# EAGLE design TP4056 PROTECTION PCB (EAGLE 9.3.1)
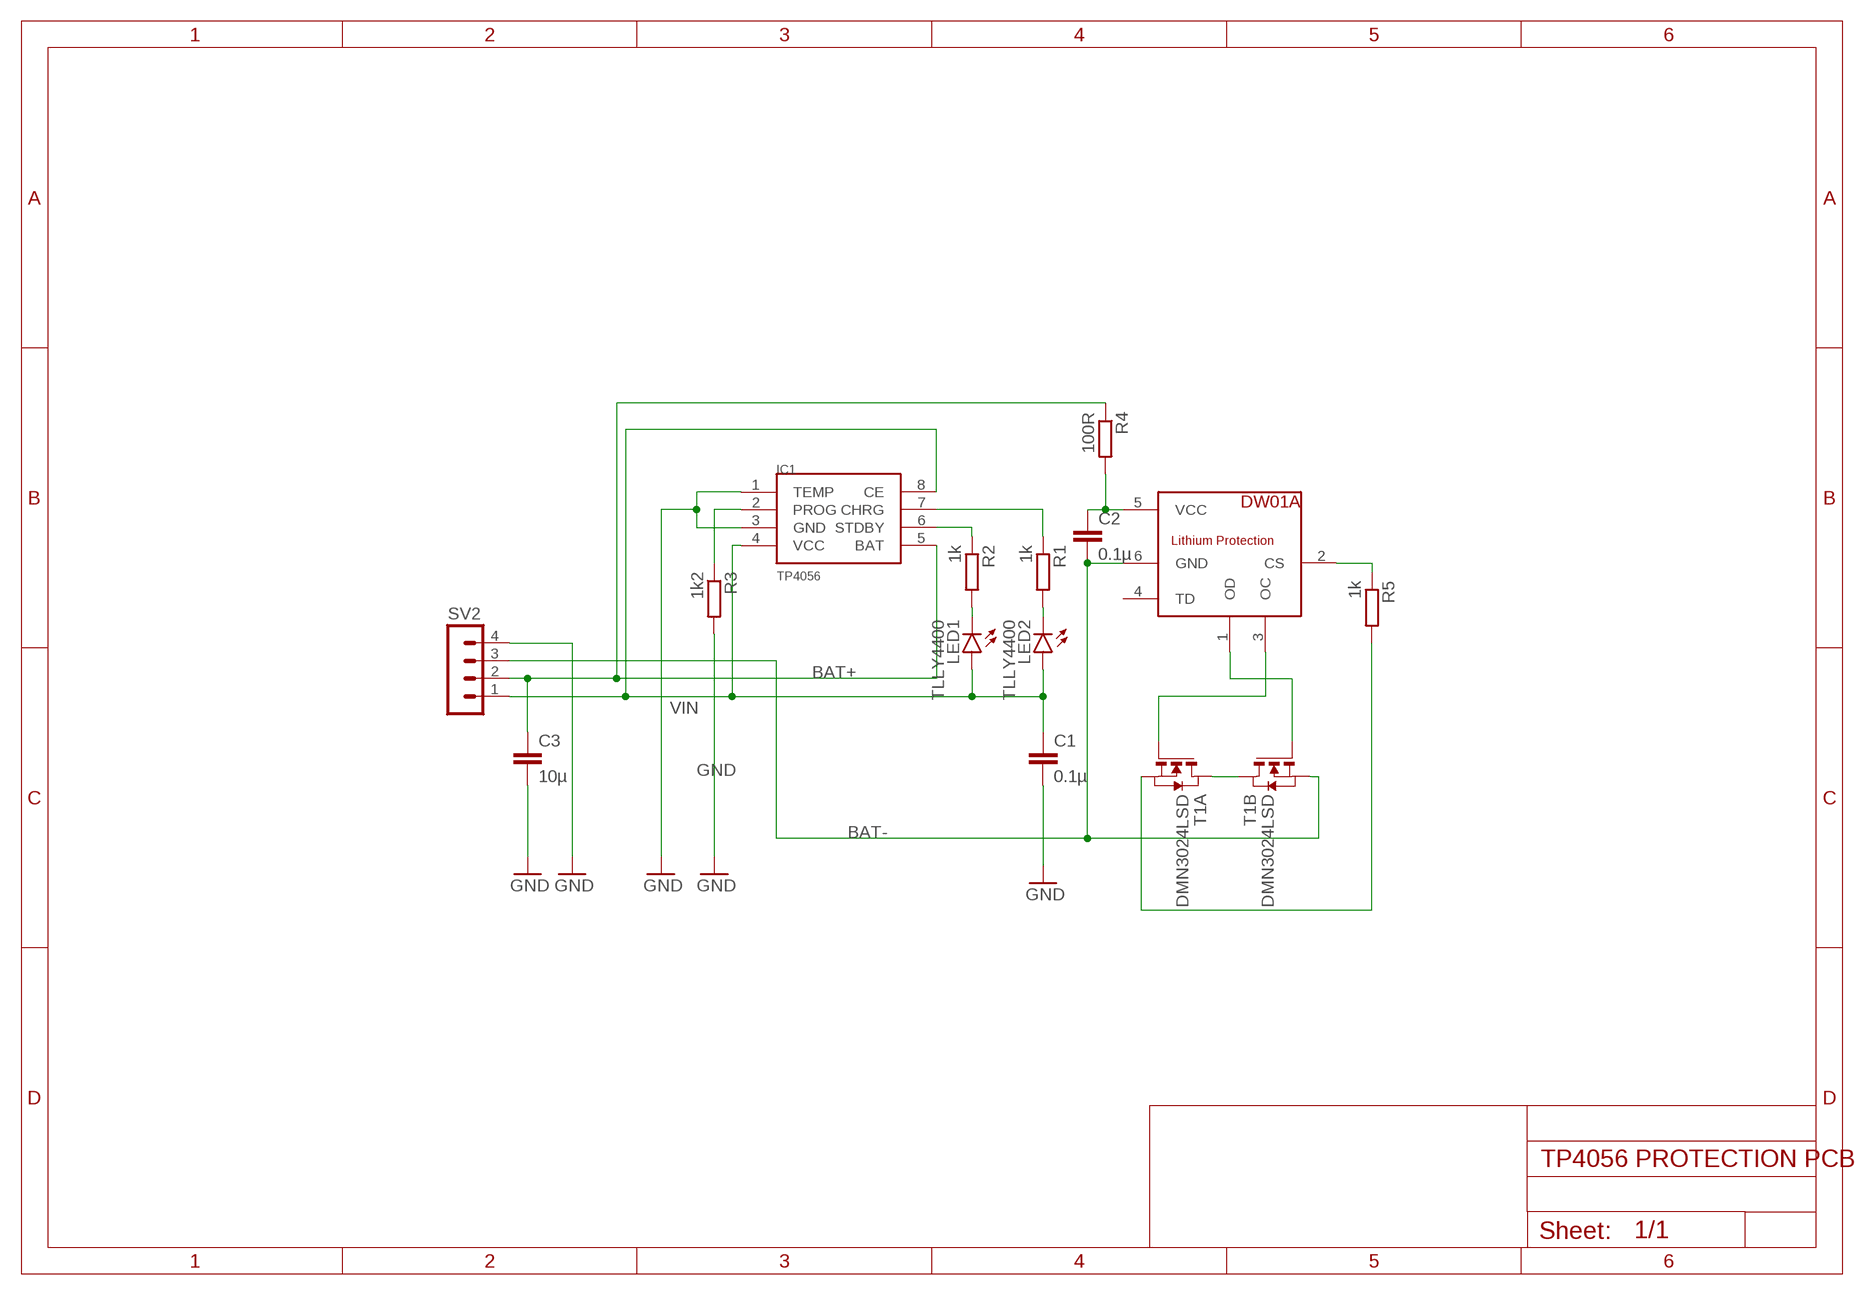
[diagram p0: schematic, sheet 1]

## Parts
C1  0.1µ  C-EUC1206  [C1206]
C2  0.1µ  C-EUC1206  [C1206]
C3  10µ  C-EUC1206  [C1206]
IC1  TP4056  [SOP-8]
LED1  TLLY4400  [LED3MM]
LED2  TLLY4400  [LED3MM]
R1  1k  R-EU_R1206W  [R1206W]
R2  1k  R-EU_R1206W  [R1206W]
R3  1k2  R-EU_R1206W  [R1206W]
R4  100R  R-EU_R1206W  [R1206W]
R5  1k  R-EU_R1206W  [R1206W]
SV2  MA04-1  [MA04-1]
T1  DMN3024LSD  [TSSOP-8]
U$1  DW01A  [SOT23-6]

## Nets
BAT+: C3.1 IC1.5(BAT) R4.1 SV2.2
BAT-: C2.2 SV2.3 T1.6(B:S) T1.7(B:S) U$1.6(GND)
GND: C1.2 C3.2 IC1.1(TEMP) IC1.3(GND) R3.2 SV2.4
N$1: IC1.6(STDBY) R2.1
N$2: IC1.7(CHRG) R1.1
N$3: LED2.K(C) R1.2
N$4: LED1.K(C) R2.2
N$5: C2.1 R4.2 U$1.5(VCC)
N$7: R5.1 U$1.2(CS)
N$8: IC1.2(PROG) R3.1
N$9: T1.4(A:G) U$1.3(OC)
N$10: T1.5(B:G) U$1.1(OD)
N$11: T1.1(A:D) T1.8(B:D)
N$12: R5.2 T1.2(A:S) T1.3(A:S)
VIN: C1.1 IC1.4(VCC) IC1.8(CE) LED1.A LED2.A SV2.1
Unconnected: U$1.4(TD)

## Library data of the parts
C1-C3 = rcl:C-EU: CAPACITOR, European symbol; SPICEPREFIX: C
IC1 = TP4056:TP4056
LED1 LED2 = led:TLLY4400: Low Current (2mA) LED 3 mm Tinted Diffused Package color YELLOW Source: Data sheet <http://www.farnell.com/datasheets/391098.pdf>; MF: VISHAY SEMICONDUCTOR; OC_FARNELL: 1612439
R1-R5 = rcl:R-EU_: RESISTOR, European symbol; SPICEPREFIX: R
SV2 = con-lstb:MA04-1: PIN HEADER; OC_FARNELL: unknown; OC_NEWARK: unknown
T1 = FS8205A:DMN3024LSD: DUAL N-CHANNEL ENHANCEMENT MODE MOSFET data sheet <http://goo.gl/dRgboR> Dave.Calaway Eagle Library <https://goo.gl/Muy1Tr>
U$1 = DW01A:DW01A

## Board
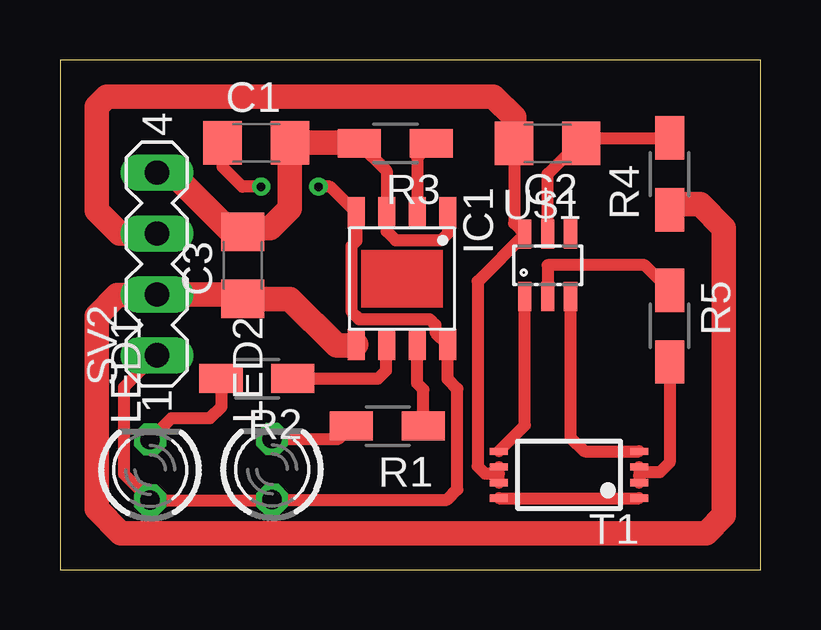
[diagram p1: board, top side]
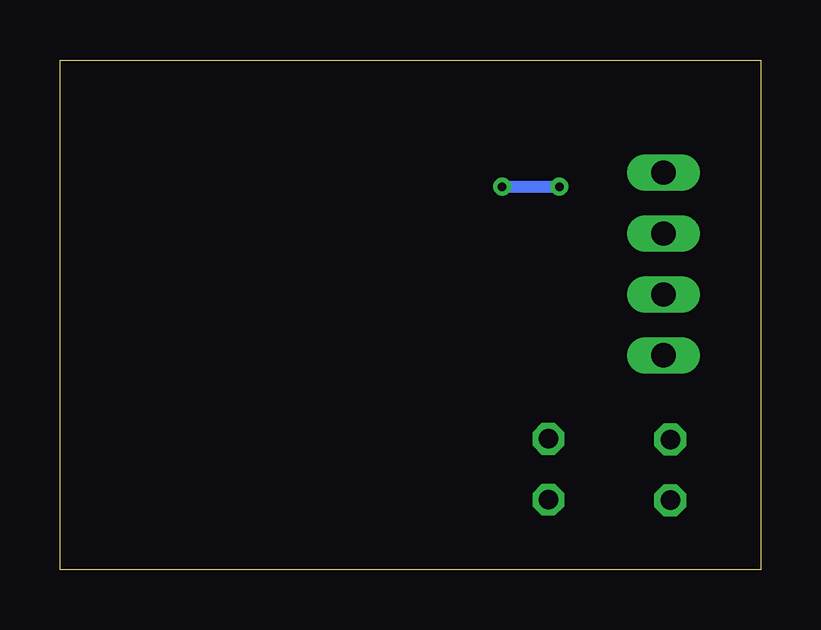
[diagram p2: board, bottom side, seen from below]

Size 29.19 x 21.26 mm. Coordinates in mm from the lower left corner, seen from the top.
Outline: 0,0 29.19,0 29.19,21.26 0,21.26 0,0
Copper layers (1*16): Top 0.035mm / dielectric 1.5mm / Bottom 0.035mm
Design rules "default": minimum track width 6mil, minimum drill 0.35mm, track to track 6mil, track to pad 6mil, pad to pad 6mil, via to via 6mil, smd to smd 6mil, copper to edge 40mil, drill to drill 6mil, minimum pad ring 10mil, minimum via ring 8mil, stop-mask expansion 4mil, vias tented up to drill 0mil, thermal gap 10mil

### Footprints (pad centres in the part's own frame; a part is rotated, then mirrored left to right if it is on the bottom)
C1206 = smd 1.6 x 1.8: 1 -1.4,0; 2 1.4,0
SOP-8 = smd 1.3 x 0.7: 1 -2.75,1.905; 2 -2.75,0.635; 3 -2.75,-0.635; 4 -2.75,-1.905; 5 2.75,-1.905; 6 2.75,-0.635; 7 2.75,0.635; 8 2.75,1.905
LED3MM = drill 0.813 octagon: A -1.27,0; K 1.27,0
R1206W = smd 1.8 x 1.2: 1 -1.499,0; 2 1.499,0
MA04-1 = drill 1.016 long: 1 -3.81,0; 2 -1.27,0; 3 1.27,0; 4 3.81,0
TSSOP-8 = smd 0.3 x 0.75: 1 -0.975,-2.925; 2 -0.325,-2.925; 3 0.325,-2.925; 4 0.975,-2.925; 5 0.975,2.925; 6 0.325,2.925; 7 -0.325,2.925; 8 -0.975,2.925
SOT23-6 = smd 0.55 x 1.2: 1 -0.95,-1.3; 2 0,-1.3; 3 0.95,-1.3; 4 0.95,1.3; 5 0,1.3; 6 -0.95,1.3

### Placement (x,y rotation side)
C1  8.18,17.81 0 top
C2  20.32,17.78 180 top
C3  7.62,12.7 90 top
IC1  14.25,12.14 270 top
LED1  3.76,4.17 90 top
LED2  8.84,4.19 90 top
R1  13.64,5.99 180 top
R2  8.2,7.98 180 top
R3  13.97,17.78 180 top
R4  25.4,16.51 90 top
R5  25.4,10.16 270 top
SV2  4.04,12.75 90 top
T1  21.21,3.96 90 top
U$1  20.32,12.7 0 top

### Tracks (layer width: path | path; a pad name or v marks a point on that pad's centre or on a via)
BAT+
  Top 1.016: SV2.2 4.17,11.35 | R4.1 25.4,15.24 26.67,15.24 27.67,14.24 27.67,2.27 26.92,1.52 2.54,1.52 1.52,2.54 1.52,10.59 2.39,11.46 4.01,11.46 SV2.2 | SV2.2 7.44,11.48 C3.1 9.58,11.3 11.53,9.35 12.3,9.35 IC1.5
BAT-
  Top 0.508: C2.2 18.92,14.45 U$1.6 17.4,12.03 17.4,4.32 17.7,4.01 18.28,4.01 | T1.7 18.28,4.01 | 18.28,4.01 T1.6
  Top 1.016: SV2.3 2.49,14.02 1.52,14.99 1.52,19.3 1.96,19.74 18.06,19.74 18.92,18.88 C2.2
GND
  Top 0.508: R3.2 13.61,16.64 IC1.3 13.61,14.12 13.99,13.75 15.88,13.75 16.18,14.05 16.18,14.87 IC1.1
  Top 1.016: 4.12,16.56 SV2.4 4.65,16.56 7.11,14.1 C3.2 7.77,14.25 8.76,14.25 9.58,15.06 C1.2 12.45,17.8 R3.2
N$1
  Top 0.508: R2.1 13.26,7.98 13.59,8.31 13.59,9.37 IC1.6
N$2
  Top 0.508: 15.14,6.19 R1.1 15.14,7.52 14.88,7.77 IC1.7
N$3
  Top 0.508: LED2.K 11.61,5.46 R1.2
N$4
  Top 0.508: LED1.K 4.65,6.33 6.25,6.33 6.73,6.81 6.73,7.95 R2.2
N$5
  Top 0.508: U$1.5 20.32,16.51 21.59,17.78 C2.1 21.95,18.01 R4.2
N$7
  Top 0.508: R5.1 24.36,12.7 20.32,12.7 U$1.2
N$8
  Top 0.508: R3.1 14.88,17.2 IC1.2
N$9
  Top 0.508: U$1.3 21.27,5.53 21.86,4.94 T1.4
N$10
  Top 0.508: T1.5 19.37,6.02 U$1.1
N$11
  Top 0.508: T1.8 T1.1
N$12
  Top 0.508: T1.3 24.13,3.94 | 24.13,3.94 T1.2 | R5.2 25.4,4.47 24.99,4.06 24.26,4.06 24.13,3.94
VIN  (via drill 0.35)
  Top 0.508: 12.34,14.55 IC1.4 | SV2.1 3.99,8.94 2.67,7.62 2.67,3.99 LED1.A 8.81,2.9 LED2.A 16.13,2.92 16.56,3.35 16.56,7.54 16.15,7.95 IC1.8 15.64,9.9 15.64,10.21 15.4,10.45 12.47,10.45 12.14,10.77 12.14,13.51 12.34,13.71 IC1.4 | IC1.4 11.26,15.98 v10.77,15.98 | v8.38,15.98 7.59,15.98 6.78,16.79 C1.1
  Bottom 0.508: v10.77,15.98 v8.38,15.98 | v8.38,15.98 8.36,15.98 8.33,15.95 8.36,15.95 v8.38,15.98